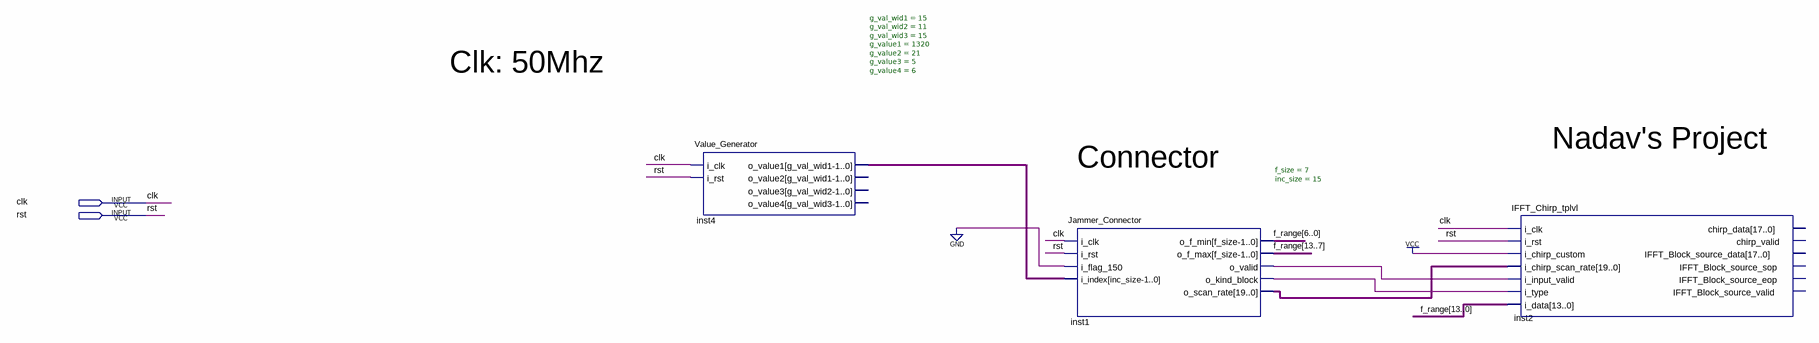
[diagram p0: schematic sheet]
// Quartus schematic Ortiada_TEST_BDF.bdf as structural Verilog: 3 symbols, 2 pins
module Ortiada_TEST_BDF (
  input  clk,
  input  rst
);

  wire inst1_o_kind_block, inst1_o_valid;
  wire [13:0] f_range;
  wire [14:0] inst4_o_value1;
  wire [19:0] inst1_o_scan_rate;

  Value_Generator #(.g_val_wid1(15), .g_val_wid2(11), .g_val_wid3(15), .g_value1(1320), .g_value2(21), .g_value3(5), .g_value4(6)) inst4 (
    .i_clk(clk), .i_rst(rst), .o_value1(inst4_o_value1));  // open: o_value2, o_value3, o_value4
  Jammer_Connector #(.f_size(7), .inc_size(15)) inst1 (
    .i_clk(clk), .i_rst(rst), .i_flag_150(1'b0), .i_index(inst4_o_value1), .o_f_min(f_range[6:0]),
    .o_f_max(f_range[13:7]), .o_valid(inst1_o_valid), .o_kind_block(inst1_o_kind_block),
    .o_scan_rate(inst1_o_scan_rate));
  IFFT_Chirp_tplvl inst2 (
    .i_clk(clk), .i_rst(rst), .i_chirp_custom(1'b1), .i_chirp_scan_rate(inst1_o_scan_rate),
    .i_input_valid(inst1_o_valid), .i_type(inst1_o_kind_block), .i_data(f_range));  // open: chirp_data, chirp_valid, IFFT_Block_source_data, IFFT_Block_source_sop, IFFT_Block_source_eop, IFFT_Block_source_valid

  // Notes on the sheet:
  //   Clk: 50Mhz
  //   Nadav's Project
  //   Connector
endmodule
